# EAGLE design flt (EAGLE 8.1.1)
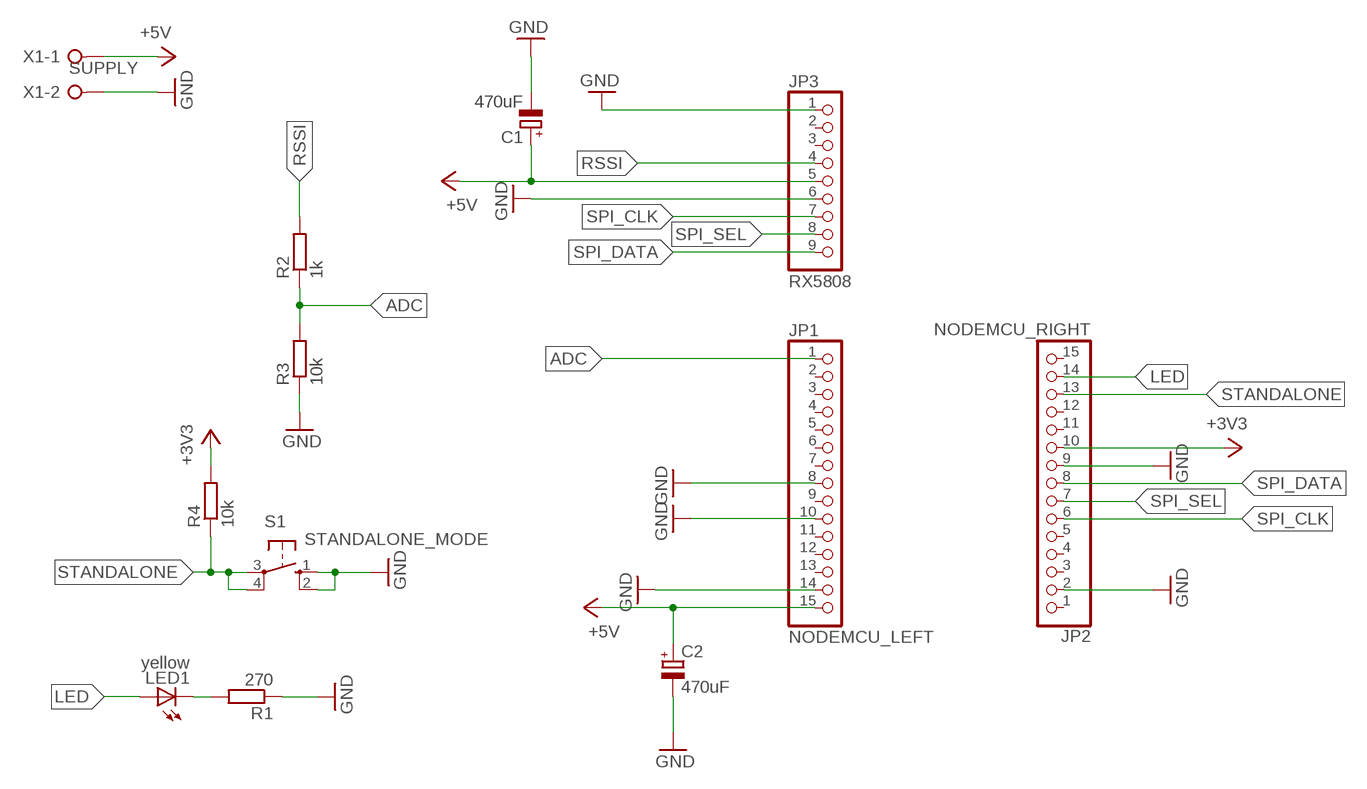
[diagram p0: schematic, sheet 1]

## Parts
C1  470uF  CPOL-EUE5-8.5  [E5-8,5]
C2  470uF  CPOL-EUE5-8.5  [E5-8,5]
JP1  NODEMCU_LEFT  PINHD-1X15  [1X15]
JP2  NODEMCU_RIGHT  PINHD-1X15  [1X15]
JP3  RX5808  PINHD-1X9  [1X09]
LED1  yellow  LED5MM  [LED5MM]
R1  270  R-EU_0204/7  [0204/7]
R2  1k  R-EU_0204/7  [0204/7]
R3  10k  R-EU_0204/7  [0204/7]
R4  10k  R-EU_0204/7  [0204/7]
S1  STANDALONE_MODE  10-XX  [B3F-10XX]
X1  SUPPLY  W237-02P  [W237-132]

## Nets
+3V3: JP2.10 R4.2
+5V: C1.+ C2.+ JP1.15 JP3.5 X1.1
ADC: JP1.1 R2.1 R3.2
GND: C1.- C2.- JP1.8 JP1.10 JP1.14 JP2.2 JP2.9 JP3.1 JP3.6 R1.1 R3.1 S1.1(S) S1.2(S1) X1.2
LED: JP2.14 LED1.A
N$3: LED1.K(C) R1.2
RSSI: JP3.4 R2.2
SPI_CLK: JP2.6 JP3.7
SPI_DATA: JP2.8 JP3.9
SPI_SEL: JP2.7 JP3.8
STANDALONE: JP2.13 R4.1 S1.3(P) S1.4(P1)
Unconnected: JP1.2 JP1.3 JP1.4 JP1.5 JP1.6 JP1.7 JP1.9 JP1.11 JP1.12 JP1.13 JP2.1 JP2.3 JP2.4 JP2.5 JP2.11 JP2.12 JP2.15 JP3.2 JP3.3

## Library data of the parts
C1 C2 = rcl:CPOL-EU: POLARIZED CAPACITOR, European symbol
JP1 JP2 = pinhead:PINHD-1X15: PIN HEADER
JP3 = pinhead:PINHD-1X9: PIN HEADER
LED1 = led:LED: LED OSRAM: - CHIPLED LG R971, LG N971, LY N971, LG Q971, LY Q971, LO R971, LY R971 LH N974, LH R974 LS Q976, LO Q976, LY Q976 LO Q996 - Hyper CHIPLED LW Q18S LB Q993, LB Q99A, LB R99A - SideLED LS A670, LO A670, LY A670, LG A670, LP A670 LB A673, LV A673, LT A673, LW A673 LH A674 LY A675 LS A676, LA A676, LO A676, LY A676, LW A676 LS A679, LY A679, LG A679 - Hyper Micro SIDELED® LS Y876, LA Y876, LO Y876, LY Y876 LT Y87S - SmartLED LW L88C, LW L88S LB L89C, LB L89S, LG L890 LS L89K, LO L89K, LY L89K LS L896, LA L896, LO L896, LY L896 - TOPLED LS T670, LO T670, LY T670, LG T670, LP T670 LSG T670, LSP T670, LSY T670, LOP T670, LYG T670 LG T671, LOG T671, LSG T671 LB T673, LV T673, LT T673, LW T673 LH T674 LS T676, LA T676, LO T676, LY T676, LB T676, LH T676, LSB T676, LW T676 LB T67C, LV T67C, LT T67C, LS T67K, LO T67K, LY T67K, LW E67C LS E67B, LA E67B, LO E67B, LY E67B, LB E67C, LV E67C, LT E67C LW T67C LS T679, LY T679, LG T679 LS T770, LO T770, LY T770, LG T770, LP T770 LB T773, LV T773, LT T773, LW T773 LH T774 LS E675, LA E675, LY E675, LS T675 LS T776, LA T776, LO T776, LY T776, LB T776 LHGB T686 LT T68C, LB T68C - Hyper Mini TOPLED® LB M676 - Mini TOPLED Santana® LG M470 LS M47K, LO M47K, LY M47K Source: http://www.osram.convergy.de LUXEON: - LUMILED® LXK2-PW12-R00, LXK2-PW12-S00, LXK2-PW14-U00, LXK2-PW14-V00 LXK2-PM12-R00, LXK2-PM12-S00, LXK2-PM14-U00 LXK2-PE12-Q00, LXK2-PE12-R00, LXK2-PE12-S00, LXK2-PE14-T00, LXK2-PE14-U00 LXK2-PB12-K00, LXK2-PB12-L00, LXK2-PB12-M00, LXK2-PB14-N00, LXK2-PB14-P00, LXK2-PB14-Q00 LXK2-PR12-L00, LXK2-PR12-M00, LXK2-PR14-Q00, LXK2-PR14-R00 LXK2-PD12-Q00, LXK2-PD12-R00, LXK2-PD12-S00 LXK2-PH12-R00, LXK2-PH12-S00 LXK2-PL12-P00, LXK2-PL12-Q00, LXK2-PL12-R00 Source: www.luxeon.com KINGBRIGHT: KA-3528ASYC Source: www.kingbright.com
R1-R4 = rcl:R-EU_: RESISTOR, European symbol
S1 = switch-omron:10-XX: OMRON SWITCH; MPN: B3F-1000; OC_FARNELL: 176432; OC_NEWARK: 36M3542
X1 = con-wago-508:W237-02P: WAGO SREW CLAMP; OC_FARNELL: unknown; OC_NEWARK: unknown

## Board
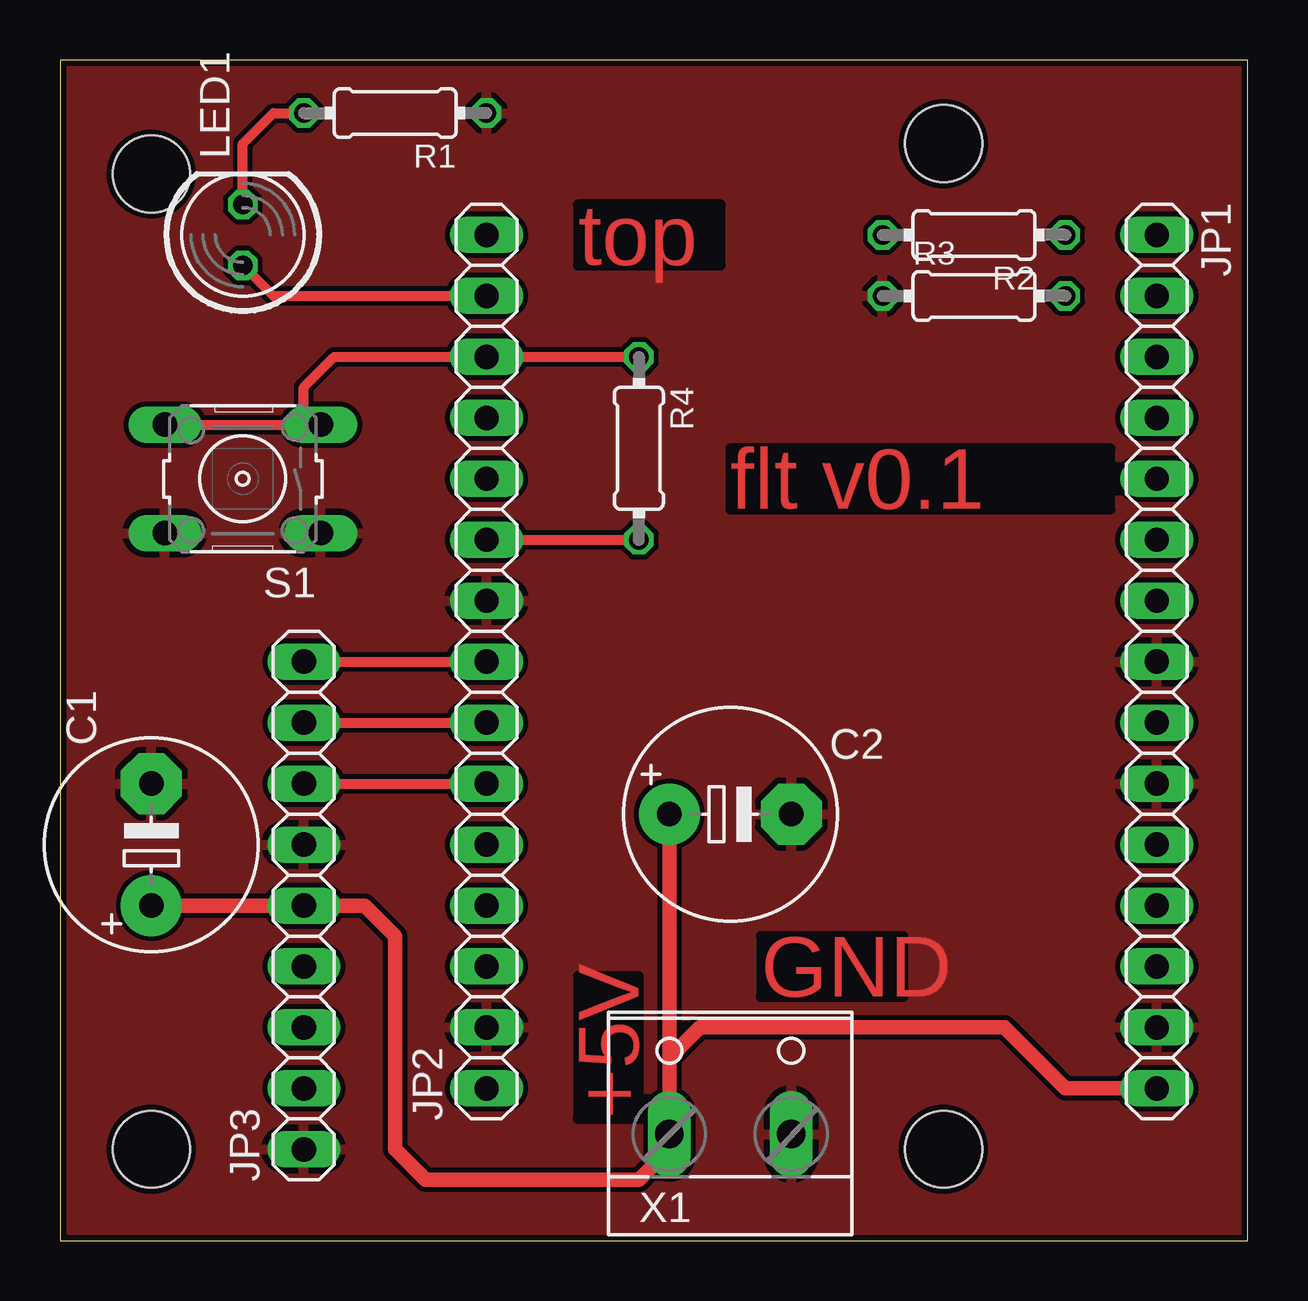
[diagram p1: board, top side]
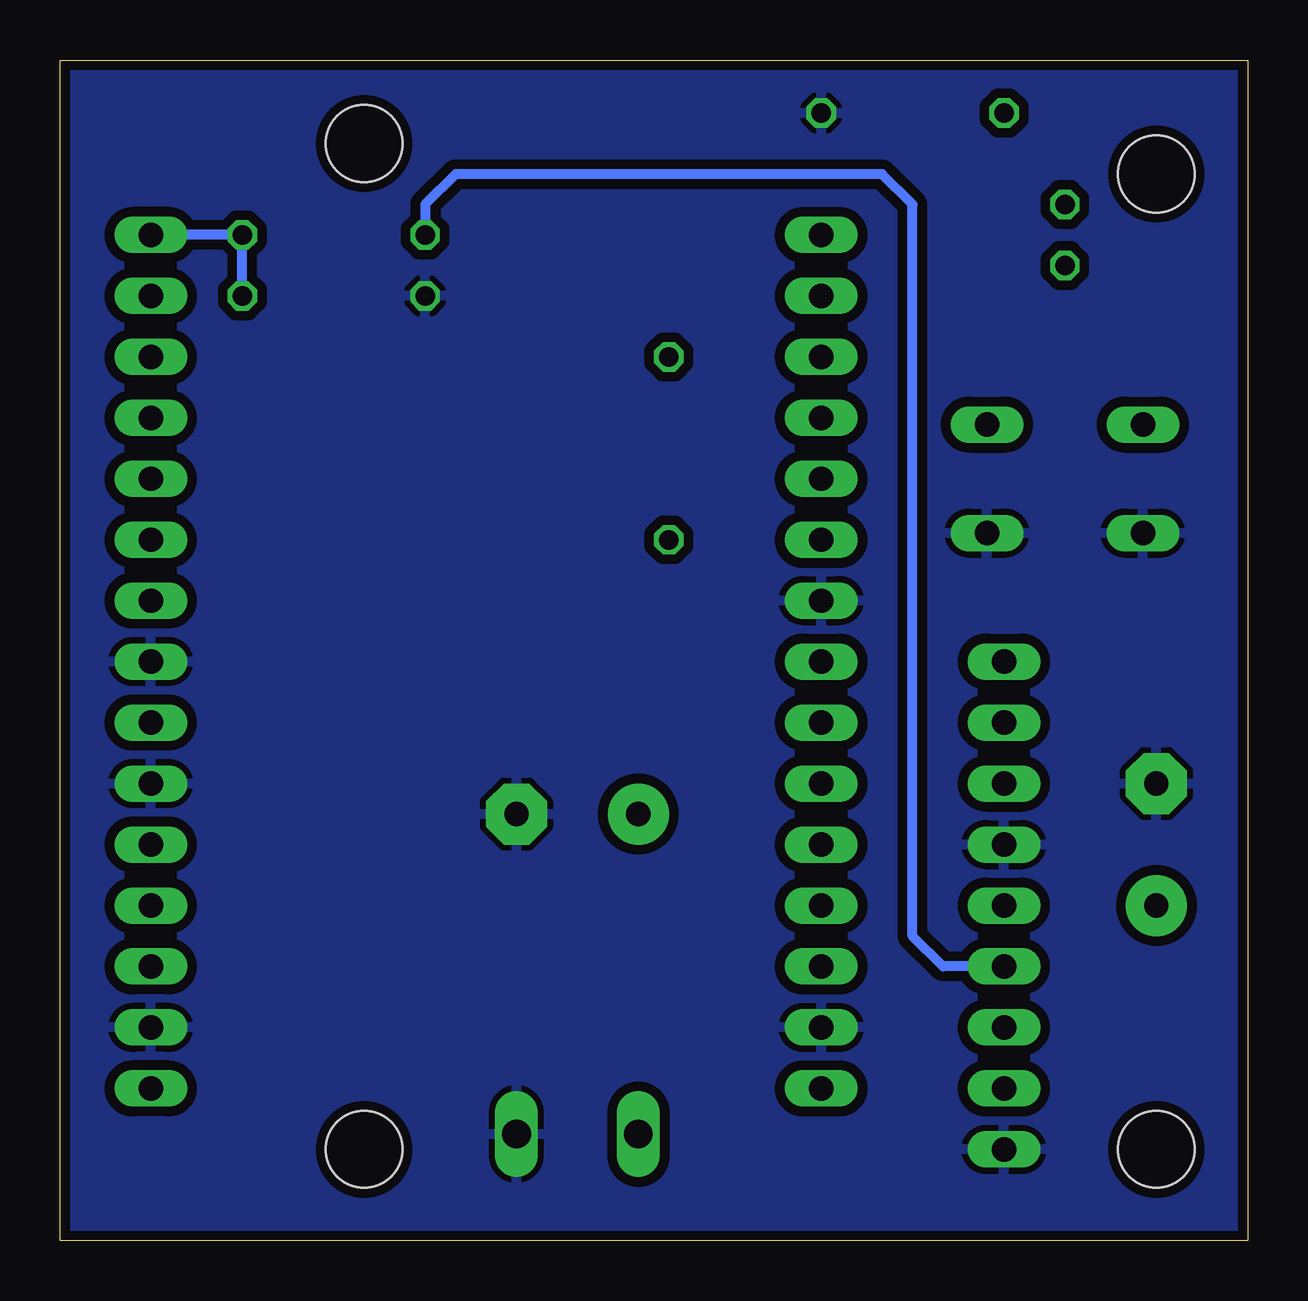
[diagram p2: board, bottom side, seen from below]

Size 49.51 x 49.2 mm. Coordinates in mm from the lower left corner, seen from the top.
Outline: 0,0 49.51,0 49.51,49.2 0,49.2 0,0
Copper layers (1*16): Top 0.035mm / dielectric 1.5mm / Bottom 0.035mm
Design rules "ITEADstudio-edited-8mil": minimum track width 8mil, minimum drill 0.3mm, track to track 8mil, track to pad 8mil, pad to pad 8mil, via to via 8mil, smd to smd 0mil, copper to edge 10mil, drill to drill 10mil, minimum pad ring 8mil, minimum via ring 6mil, stop-mask expansion 0.1mm, vias tented up to drill 100mil, thermal gap 10mil
Holes 3.2 mm at 3.81,44.45 36.83,45.72 36.83,3.81 3.81,3.81

### Footprints (pad centres in the part's own frame; a part is rotated, then mirrored left to right if it is on the bottom)
E5-8,5 = drill 1.016 pad 2.54: + -2.54,0 | drill 1.016 pad 2.54 octagon: - 2.54,0
1X15 = drill 1.016 long: 1 -17.78,0; 2 -15.24,0; 3 -12.7,0; 4 -10.16,0; 5 -7.62,0; 6 -5.08,0; 7 -2.54,0; 8 0,0; 9 2.54,0; 10 5.08,0; 11 7.62,0; 12 10.16,0; 13 12.7,0; 14 15.24,0; 15 17.78,0
1X09 = drill 1.016 long: 1 -10.16,0; 2 -7.62,0; 3 -5.08,0; 4 -2.54,0; 5 0,0; 6 2.54,0; 7 5.08,0; 8 7.62,0; 9 10.16,0
LED5MM = drill 0.813 octagon: A -1.27,0; K 1.27,0
0204/7 = drill 0.813 octagon: 1 -3.81,0; 2 3.81,0
B3F-10XX = drill 1.016 long: 1 -3.251,2.261; 2 3.251,2.261; 3 -3.251,-2.261; 4 3.251,-2.261
W237-132 = drill 1.194 long: 1 -2.54,-0.635; 2 2.54,-0.635

### Placement (x,y rotation side)
C1  3.81,16.51 90 top
C2  27.94,17.78 0 top
JP1  45.72,24.13 270 top
JP2  17.78,24.13 90 top
JP3  10.16,13.97 90 top
LED1  7.62,41.91 90 top
R1  13.97,46.99 180 top
R2  38.1,41.91 180 top
R3  38.1,39.37 0 top
R4  24.13,33.02 270 top
S1  7.62,31.75 180 top
X1  27.94,5.08 0 top

### Tracks (layer width: path | path; a pad name or v marks a point on that pad's centre or on a via)
+3V3
  Top 0.406: JP2.10 R4.2
+5V
  Top 0.61: C1.+ JP3.5 12.7,13.97 13.97,12.7 13.97,3.81 15.24,2.54 24.13,2.54 25.4,3.81 X1.1 25.4,7.62 | 25.4,7.62 C2.+ | JP1.15 41.91,6.35 39.37,8.89 26.67,8.89 25.4,7.62
ADC
  Bottom 0.406: R3.2 R2.1 JP1.1
GND
  pour Bottom (isolate 0.406): 0,0 49.53,0 49.53,49.53 0,49.53
  pour Top: 0,0 49.53,0 49.53,49.53 0,49.53
LED
  Top 0.406: JP2.14 8.89,39.37 LED1.A
N$3
  Top 0.406: LED1.K 7.62,45.72 8.89,46.99 R1.2
RSSI
  Bottom 0.406: JP3.4 12.7,11.43 13.97,12.7 13.97,43.18 15.24,44.45 33.02,44.45 34.29,43.18 R2.2
SPI_CLK
  Top 0.406: JP3.7 JP2.6
SPI_DATA
  Top 0.406: JP3.9 JP2.8
SPI_SEL
  Top 0.406: JP3.8 JP2.7
STANDALONE
  Top 0.406: S1.4 10.16,34.01 | 10.16,34.01 S1.3 | R4.1 JP2.13 11.43,36.83 10.16,35.56 10.16,34.01

### Text on the board
Top: top | flt v0.1 | GND | +5V